# EAGLE design 2TE_Drossel (EAGLE 5.00)
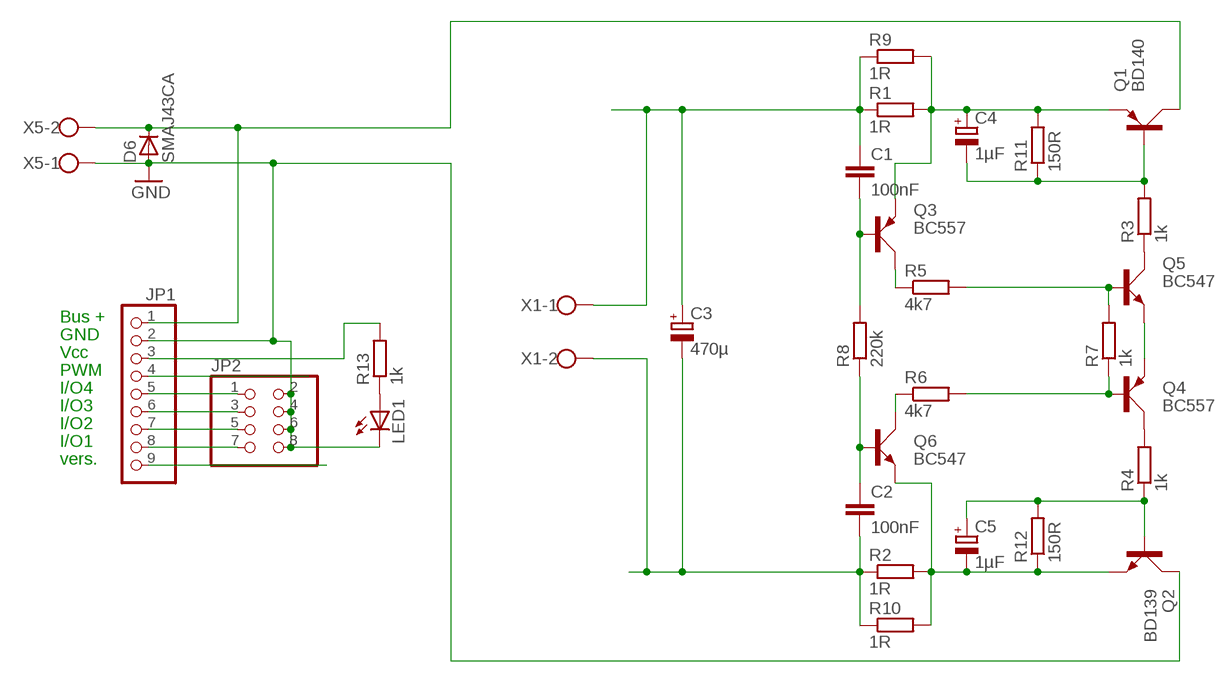
[diagram p0: schematic, sheet 1]

## Parts
C1  100nF  C-EU050-024X044  [C050-024X044]
C2  100nF  C-EU050-024X044  [C050-024X044]
C3  470µ  CPOL-EUE3.5-8  [E3,5-8]
C4  1µF  CPOL-EUE2.5-5  [E2,5-5]
C5  1µF  CPOL-EUE2.5-5  [E2,5-5]
D6  SMAJ43CA  D-SMB  [SMB]
JP1  PINHD-1X9  [1X09]
JP2  PINHD-2X4  [2X04]
LED1  LED3MM  [LED3MM]
Q1  BD140  [TO126AV]
Q2  BD139  [TO126AV]
Q3  BC557  [SOT54A]
Q4  BC557  [SOT54A]
Q5  BC547  [SOT54A]
Q6  BC547  [SOT54A]
R1  1R  R-EU_0207/10  [0207/10]
R2  1R  R-EU_0207/10  [0207/10]
R3  1k  R-EU_0207/10  [0207/10]
R4  1k  R-EU_0207/10  [0207/10]
R5  4k7  R-EU_0207/10  [0207/10]
R6  4k7  R-EU_0207/10  [0207/10]
R7  1k  R-EU_0207/10  [0207/10]
R8  220k  R-EU_0207/10  [0207/10]
R9  1R  R-EU_0207/10  [0207/10]
R10  1R  R-EU_0207/10  [0207/10]
R11  150R  R-EU_0207/10  [0207/10]
R12  150R  R-EU_0207/10  [0207/10]
R13  1k  R-EU_0207/10  [0207/10]
X1  W237-02P  [W237-132]
X5  W237-02P  [W237-132]

## Nets
+15V: C1.1 C3.+ R1.1 R9.1 X1.1
-15V: C2.2 C3.- R2.1 R10.1 X1.2
GND: D6.2(A) JP1.2 JP2.2 JP2.4 JP2.6 JP2.8 LED1.K(C) Q2.C X5.1
IO1: JP1.8 JP2.7
IO2: JP1.7 JP2.5
IO3: JP1.6 JP2.3
IO4: JP1.5 JP2.1
N$1: C4.+ Q1.E Q3.E R1.2 R9.2 R11.2
N$2: Q4.C R4.2
N$3: JP1.9
N$4: LED1.A R13.1
N$5: Q5.C R3.1
N$6: C5.- Q2.E Q6.E R2.2 R10.2 R12.1
N$7: C1.2 Q3.B R8.2
N$8: C2.1 Q6.B R8.1
N$9: Q5.B R5.2 R7.2
N$10: Q6.C R6.1
N$11: C4.- Q1.B R3.2 R11.1
N$12: JP1.4
N$13: C5.+ Q2.B R4.1 R12.2
N$14: Q3.C R5.1
N$15: JP1.3 R13.2
N$16: Q4.B R6.2 R7.1
N$17: Q4.E Q5.E
V+: D6.1(C) JP1.1 Q1.C X5.2

## Notes on the sheet
- Bus +
- GND
- Vcc
- PWM
- I/O4
- I/O3
- I/O2
- I/O1
- vers.

## Library data of the parts
C1 C2 = rcl:C-EU: CAPACITOR, European symbol
C3-C5 = rcl:CPOL-EU: POLARIZED CAPACITOR, European symbol
D6 = semicon-smd-ipc:D-: DIODE unfilled
JP1 = pinhead:PINHD-1X9: PIN HEADER
JP2 = pinhead:PINHD-2X4: PIN HEADER
LED1 = led:LED: LED OSRAM: - CHIPLED LG R971, LG N971, LY N971, LG Q971, LY Q971, LO R971, LY R971 LH N974, LH R974 LS Q976, LO Q976, LY Q976 LO Q996 - Hyper CHIPLED LW Q18S LB Q993, LB Q99A, LB R99A - SideLED LS A670, LO A670, LY A670, LG A670, LP A670 LB A673, LV A673, LT A673, LW A673 LH A674 LY A675 LS A676, LA A676, LO A676, LY A676, LW A676 LS A679, LY A679, LG A679 - Hyper Micro SIDELED® LS Y876, LA Y876, LO Y876, LY Y876 LT Y87S - SmartLED LW L88C, LW L88S LB L89C, LB L89S, LG L890 LS L89K, LO L89K, LY L89K LS L896, LA L896, LO L896, LY L896 - TOPLED LS T670, LO T670, LY T670, LG T670, LP T670 LSG T670, LSP T670, LSY T670, LOP T670, LYG T670 LG T671, LOG T671, LSG T671 LB T673, LV T673, LT T673, LW T673 LH T674 LS T676, LA T676, LO T676, LY T676, LB T676, LH T676, LSB T676, LW T676 LB T67C, LV T67C, LT T67C, LS T67K, LO T67K, LY T67K, LW E67C LS E67B, LA E67B, LO E67B, LY E67B, LB E67C, LV E67C, LT E67C LW T67C LS T679, LY T679, LG T679 LS T770, LO T770, LY T770, LG T770, LP T770 LB T773, LV T773, LT T773, LW T773 LH T774 LS E675, LA E675, LY E675, LS T675 LS T776, LA T776, LO T776, LY T776, LB T776 LHGB T686 LT T68C, LB T68C - Hyper Mini TOPLED® LB M676 - Mini TOPLED Santana® LG M470 LS M47K, LO M47K, LY M47K Source: http://www.osram.convergy.de - LUMILED® LXK2-PW12-R00, LXK2-PW12-S00, LXK2-PW14-U00, LXK2-PW14-V00 LXK2-PM12-R00, LXK2-PM12-S00, LXK2-PM14-U00 LXK2-PE12-Q00, LXK2-PE12-R00, LXK2-PE12-S00, LXK2-PE14-T00, LXK2-PE14-U00 LXK2-PB12-K00, LXK2-PB12-L00, LXK2-PB12-M00, LXK2-PB14-N00, LXK2-PB14-P00, LXK2-PB14-Q00 LXK2-PR12-L00, LXK2-PR12-M00, LXK2-PR14-Q00, LXK2-PR14-R00 LXK2-PD12-Q00, LXK2-PD12-R00, LXK2-PD12-S00 LXK2-PH12-R00, LXK2-PH12-S00 LXK2-PL12-P00, LXK2-PL12-Q00, LXK2-PL12-R00 Source: www.luxeon.com
Q1 = transistor-power:BD140: PNP TRANSISTOR
Q2 = transistor-power:BD139: NPN TRANSISTOR
Q3 Q4 = transistor-small-signal:BC557: PNP TRANSISTOR
Q5 Q6 = transistor-small-signal:BC547: NPN TRANSISTOR
R1-R13 = rcl:R-EU_: RESISTOR, European symbol
X1 X5 = con-wago-508:W237-02P: WAGO SREW CLAMP

## Board
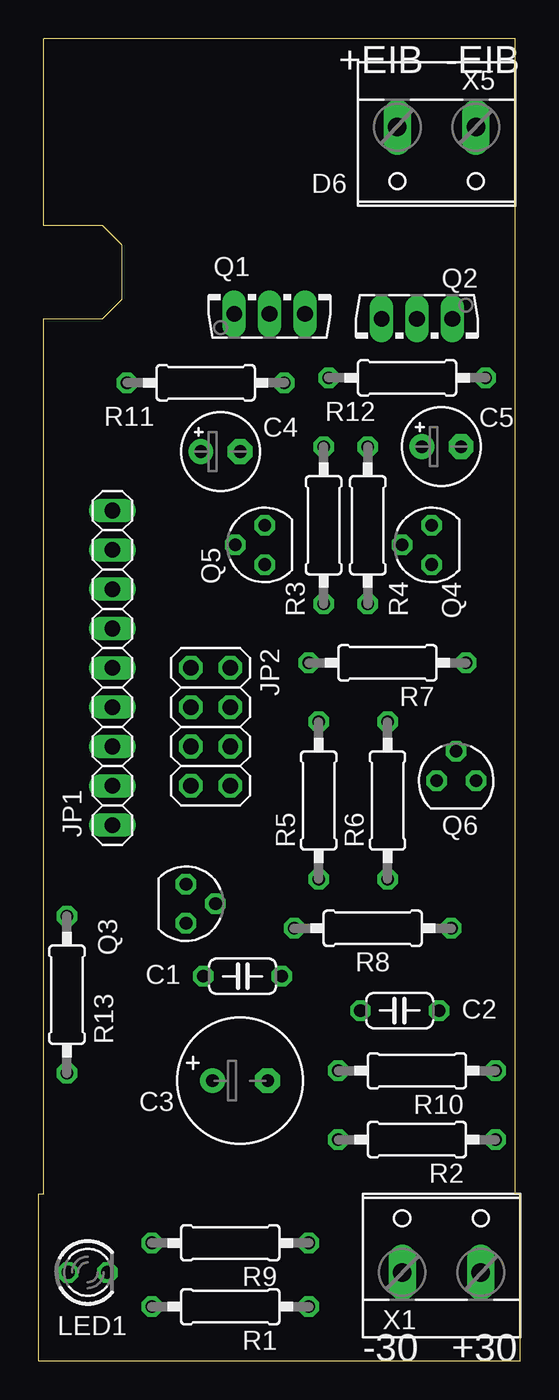
[diagram p1: board, top side]
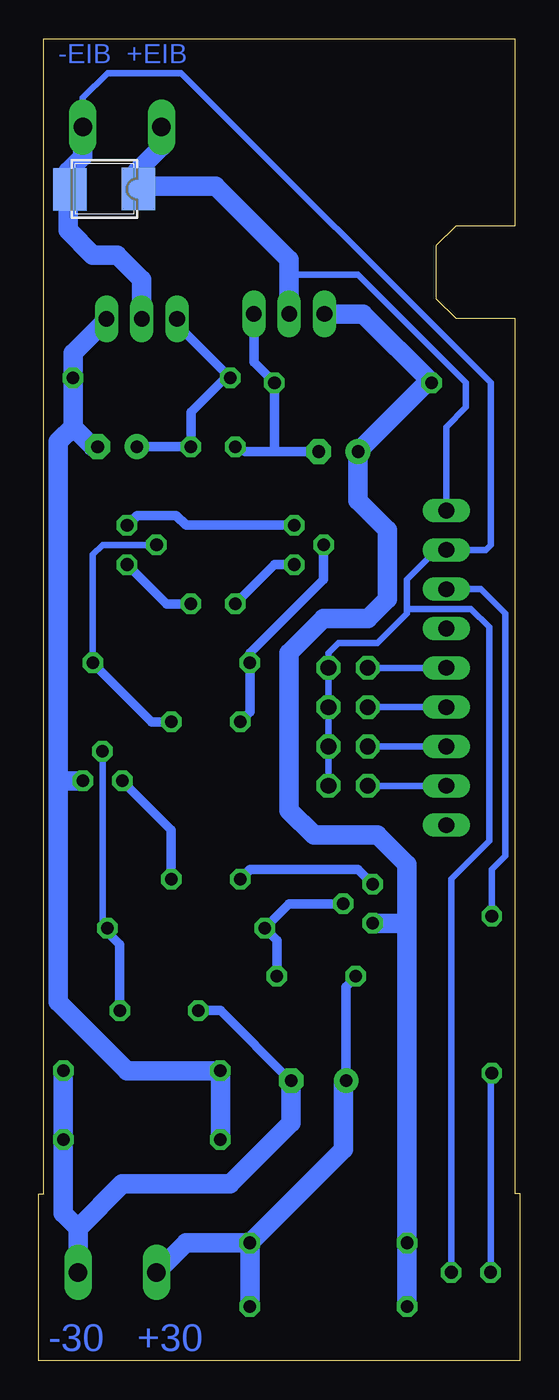
[diagram p2: board, bottom side, seen from below]

Size 31.11 x 85.41 mm. Coordinates in mm from the lower left corner, seen from the top.
Outline: 0,0 0,10.79 0.32,10.79 0.32,67.31 4.13,67.31 5.4,68.58 5.4,72.07 4.13,73.34 0.32,73.34 0.32,85.41 30.8,85.41 30.8,10.79 31.11,10.79 31.11,0 0,0
Copper layers (1*16): Top 0.035mm / dielectric 1.5mm / Bottom 0.035mm
Design rules "default *": minimum track width 10mil, minimum drill 24mil, track to track 12mil, track to pad 12mil, pad to pad 12mil, via to via 12mil, smd to smd 8mil, copper to edge 12mil, drill to drill 8mil, minimum pad ring 10mil, minimum via ring 8mil, stop-mask expansion 4mil, vias tented up to drill 0mil, thermal gap 10mil

### Footprints (pad centres in the part's own frame; a part is rotated, then mirrored left to right if it is on the bottom)
C050-024X044 = drill 0.813 octagon: 1 -2.54,0; 2 2.54,0
E3,5-8 = drill 0.813 pad 1.6 round: + -1.778,0 | drill 0.813 pad 1.6 octagon: - 1.778,0
E2,5-5 = drill 0.813 pad 1.6 round: + -1.27,0 | drill 0.813 pad 1.6 octagon: - 1.27,0
SMB = smd 2.159 x 2.743: 1 -2.311,-0.127; 2 2.108,-0.102
1X09 = drill 1.016 long: 1 -10.16,0; 2 -7.62,0; 3 -5.08,0; 4 -2.54,0; 5 0,0; 6 2.54,0; 7 5.08,0; 8 7.62,0; 9 10.16,0
2X04 = drill 1.016 octagon: 1 -3.81,-1.27; 2 -3.81,1.27; 3 -1.27,-1.27; 4 -1.27,1.27; 5 1.27,-1.27; 6 1.27,1.27; 7 3.81,-1.27; 8 3.81,1.27
LED3MM = drill 0.813 octagon: A -1.27,0; K 1.27,0
TO126AV = drill 1.016 long: B 2.286,-1.27; C 0,-1.27; E -2.286,-1.27
SOT54A = drill 0.813 octagon: B 0,1.905; C -1.27,0; E 1.27,0
0207/10 = drill 0.813 octagon: 1 -5.08,0; 2 5.08,0
W237-132 = drill 1.194 long: 1 -2.54,-0.635; 2 2.54,-0.635

### Placement (x,y rotation side)
C1  13.18,24.84 0 top
C2  23.34,22.62 180 top
C3  13.02,18.1 0 top
C4  11.75,58.74 0 top
C5  26.04,59.05 0 top
D6  26.99,75.56 180 bottom
JP1  4.76,44.77 270 top
JP2  11.11,40.96 270 top
LED1  3.17,5.71 0 top
Q1  14.92,68.9 0 top
Q2  24.45,66.04 180 top
Q3  9.53,29.53 270 top
Q4  25.4,52.7 90 top
Q5  14.61,52.7 90 top
Q6  26.99,37.47 0 top
R1  12.38,3.49 180 top
R2  24.45,14.29 180 top
R3  18.41,53.98 90 top
R4  21.27,53.98 270 top
R5  18.1,36.2 90 top
R6  22.54,36.2 90 top
R7  22.54,45.09 180 top
R8  21.59,27.94 180 top
R9  12.38,7.62 180 top
R10  24.45,18.73 180 top
R11  10.79,63.18 180 top
R12  23.81,63.5 180 top
R13  1.83,23.65 90 top
X1  26.04,6.35 0 top
X5  25.72,79.06 180 top

### Tracks (layer width: path | path; a pad name or v marks a point on that pad's centre or on a via)
+15V
  Bottom 0.61: C1.1 10.64,24.77 11.24,24.16 C3.+
  Bottom 1.27: X1.1 21.59,7.62 R9.1 | R9.1 11.43,13.65 11.43,17.78 11.11,18.1 C3.+ | R1.1 R9.1
-15V
  Bottom 0.61: C3.- 14.84,18.1 19.37,22.62 C2.2
  Bottom 1.27: R2.1 29.53,13.97 | R2.1 R10.1 | R2.1 29.53,9.53 28.58,8.57 | 28.58,8.57 X1.2 | C3.- 14.8,15.37 18.73,11.43 25.72,11.43 28.58,8.57
GND
  Bottom 0.406: JP2.8 JP2.6 JP2.4 JP2.2 12.38,45.72 11.75,46.35 9.21,46.35 7.3,48.26 7.3,48.58 | 7.3,48.58 7.3,50.48 5.4,52.39 JP1.2 2.22,52.39 1.9,52.7 1.9,63.18 21.91,83.19 26.67,83.19 28.26,81.6 X5.1 | LED1.K 4.45,31.11 1.98,33.58 1.98,47.39 3.17,48.58 7.3,48.58
  Bottom 1.27: Q2.C 24.45,69.85 26.04,71.44 27.62,71.44 29.21,73.03 29.21,75.56 | X5.1 28.26,77.79 29.21,76.83 29.21,75.56 | 29.21,75.56 29.11,75.67 D6.2
IO1
  Bottom 0.406: JP1.8 JP2.7
IO2
  Bottom 0.406: JP1.7 JP2.5
IO3
  Bottom 0.406: JP1.6 JP2.3
IO4
  Bottom 0.406: JP1.5 JP2.1
N$1
  Bottom 1.27: R1.2 R9.2 7.3,28.26 | Q1.E 10.16,67.63 R11.2 6.03,63.18 C4.+ 10.48,55.56 8.57,53.66 8.57,49.21 9.84,47.94 12.7,47.94 14.92,45.72 14.92,35.56 13.34,33.97 9.21,33.97 7.3,32.07 7.3,28.26 | 7.3,28.26 Q3.E
N$2
  Bottom 0.61: R4.2 22.86,48.9 Q4.C
N$4
  Bottom 0.406: LED1.A 1.9,18.49 R13.1
N$5
  Bottom 0.61: Q5.C 15.87,51.44 R3.1
N$6
  Bottom 1.27: Q2.E 26.73,67.25 28.89,65.09 R12.1 28.89,60.33 | C5.- 27.62,59.05 28.89,60.33 | 29.84,37.47 Q6.E | 29.84,37.47 29.84,59.37 28.89,60.33 | 29.84,37.47 29.84,23.18 25.4,18.73 R10.2 R2.2
N$7
  Bottom 0.61: Q3.B 14.92,29.53 R8.2 15.72,27.15 C1.2
N$8
  Bottom 0.406: Q6.B 26.99,28.26 R8.1
  Bottom 0.61: R8.1 26.67,27.86 26.75,27.78 25.88,26.91 C2.1
N$9
  Bottom 0.61: Q5.B 12.7,50.48 17.46,45.72 R7.2 17.46,41.91 R5.2
N$10
  Bottom 0.61: R6.1 22.54,34.29 Q6.C
N$11
  Bottom 0.61: C4.- 15.87,58.74 | 15.87,58.74 17.78,58.74 R3.2 | 15.87,58.74 R11.1 17.21,64.52 Q1.B
N$13
  Bottom 0.61: C5.+ R4.1 21.27,61.28 19.05,63.5 R12.2 22.16,66.93 Q2.B
N$14
  Bottom 0.61: Q3.C 10.48,31.75 17.46,31.75 R5.1
N$15
  Bottom 0.406: R13.2 1.83,31.75 0.95,32.62 0.95,48.26 2.54,49.85 JP1.3
N$16
  Bottom 0.406: Q4.B 26.99,52.7 27.62,52.07 R7.1
  Bottom 0.61: R6.2 23.81,41.27 R7.1
N$17
  Bottom 0.61: Q5.E 21.59,53.98 22.22,54.61 24.77,54.61 Q4.E
V+
  Bottom 0.406: 24.45,75.56 24.68,75.48 D6.1 | JP1.1 4.76,60.33 3.49,61.59 3.49,63.18 10.48,70.17 14.92,70.17
  Bottom 1.27: Q1.C 14.92,70.17 14.92,71.12 19.68,75.88 24.77,75.88 | 24.77,75.88 24.68,75.79 D6.1 24.57,75.69 24.45,75.56 24.77,75.88 | X5.2 23.18,78.42 24.77,76.83 24.77,75.88

### Text on the board
Bottom: -EIB +EIB | -30 +30
tPlace: +EIB -EIB | -30 +30